# EAGLE design untitled (EAGLE 9.6.2)
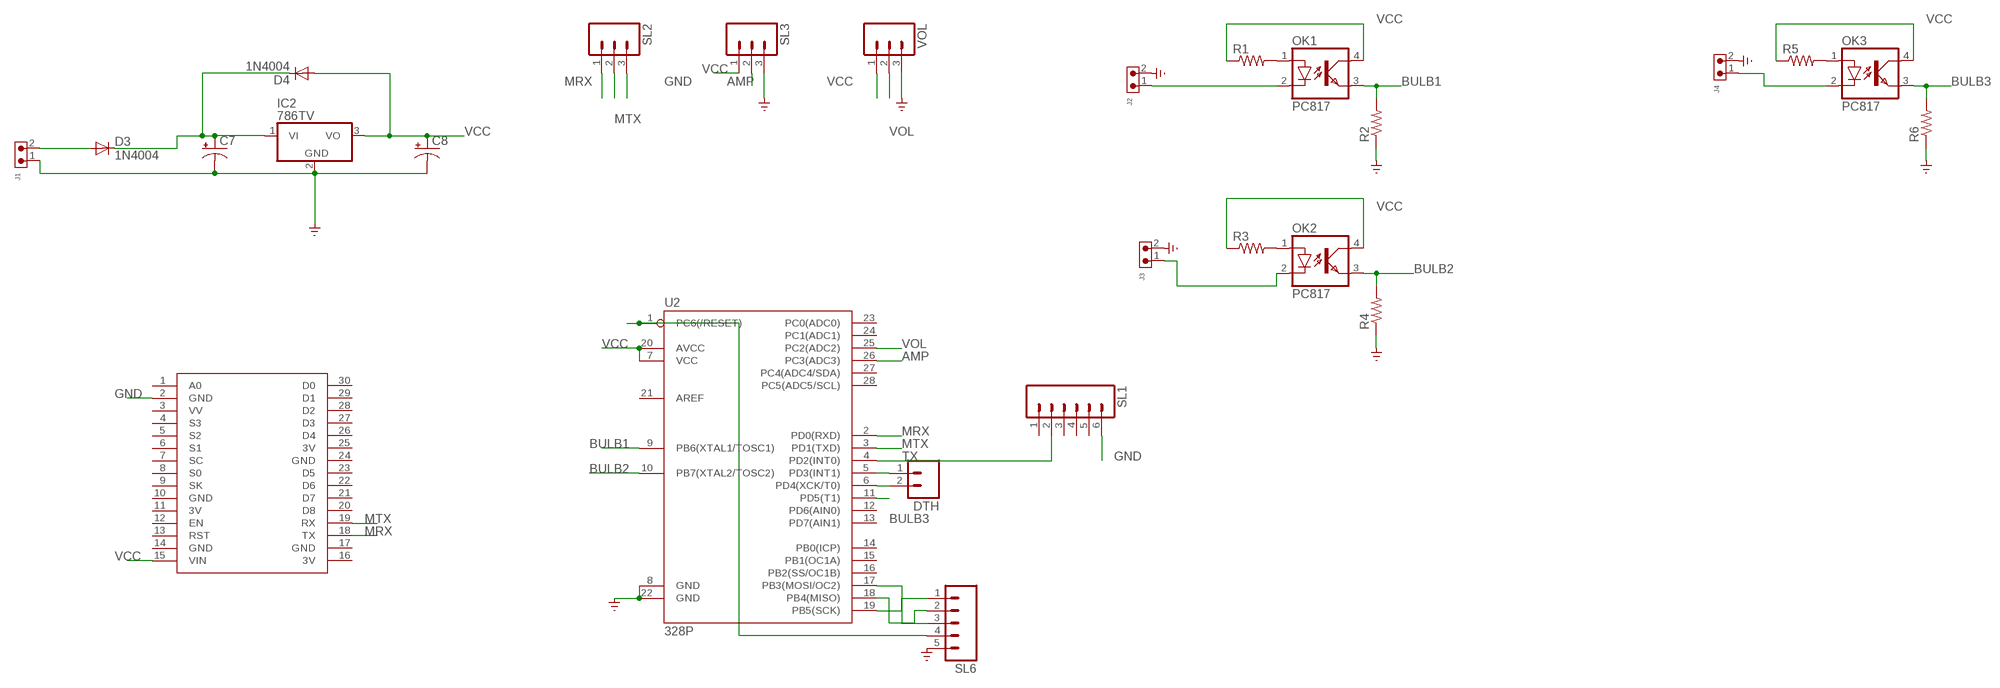
[diagram p0: schematic, sheet 1]

## Parts
C7  CAPACITOR-PE5-10.5  [E5-10,5]
C8  CAPACITOR-PE5-6  [E5-6]
D3  1N4004  [DO41-10]
D4  1N4004  [DO41-10]
DTH  M02  [02P]
IC2  786TV  [TO220V]
J1  691305530002  [691305530002]
J2  691305530002  [691305530002]
J3  691305530002  [691305530002]
J4  691305530002  [691305530002]
OK1  PC817  [DIL04]
OK2  PC817  [DIL04]
OK3  PC817  [DIL04]
R1  R-US_0207/10  [0207/10]
R2  R-US_0207/10  [0207/10]
R3  R-US_0207/10  [0207/10]
R4  R-US_0207/10  [0207/10]
R5  R-US_0207/10  [0207/10]
R6  R-US_0207/10  [0207/10]
SL1  M06  [06P]
SL2  M03  [03P]
SL3  M03  [03P]
SL6  M05  [05P]
U2  328P  ATMEGA328P_PDIP  [DIP28]
U$1  NODEMCU  [NODEMCU]
VOL  M03  [03P]

## Nets
AMP: SL3.2 U2.26(PC3(ADC3))
BULB1: OK1.3(EMIT) R2.2 U2.9(PB6(XTAL1/TOSC1))
BULB2: OK2.3(EMIT) R4.2 U2.10(PB7(XTAL2/TOSC2))
BULB3: OK3.3(EMIT) R6.2 U2.11(PD5(T1))
GND: C7.- C8.- IC2.2(GND) J1.1 J2.2 J3.2 J4.2 R2.1 R4.1 R6.1 SL1.6 SL2.3 SL3.3 SL6.5 U2.8(GND) U2.22(GND) U$1.2(GND) VOL.3 ; supply symbol labelled SUPPLY_BRASTAN_GND_
MRX: SL2.1 U2.2(PD0(RXD)) U$1.18(TX)
MTX: SL2.2 U2.3(PD1(TXD)) U$1.19(RX)
N$1: OK1.1(A) R1.2
N$2: DTH.1 U2.5(PD3(INT1))
N$4: DTH.2 U2.6(PD4(XCK/T0))
N$5: OK2.1(A) R3.2
N$6: OK3.1(A) R5.2
N$9: J2.1 OK1.2(C)
N$11: C7.+ D3.C D4.C IC2.1(VI)
N$12: J3.1 OK2.2(C)
N$14: SL6.4 U2.1(PC6(/RESET))
N$15: J4.1 OK3.2(C)
N$16: SL6.1 U2.19(PB5(SCK))
N$17: SL6.2 U2.18(PB4(MISO))
N$18: SL6.3 U2.17(PB3(MOSI/OC2))
N$21: D3.A J1.2
TX: SL1.2 U2.4(PD2(INT0))
VCC: C8.+ D4.A IC2.3(VO) OK1.4(COL) OK2.4(COL) OK3.4(COL) R1.1 R3.1 R5.1 SL3.1 U2.7(VCC) U2.20(AVCC) U$1.15(VIN) VOL.1
VOL: U2.25(PC2(ADC2)) VOL.2
Unconnected: SL1.1 SL1.3 SL1.4 SL1.5 U2.12(PD6(AIN0)) U2.13(PD7(AIN1)) U2.14(PB0(ICP)) U2.15(PB1(OC1A)) U2.16(PB2(SS/OC1B)) U2.21(AREF) U2.23(PC0(ADC0)) U2.24(PC1(ADC1)) U2.27(PC4(ADC4/SDA)) U2.28(PC5(ADC5/SCL)) U$1.1(A0) U$1.3(VV) U$1.4(S3) U$1.5(S2) U$1.6(S1) U$1.7(SC) U$1.8(S0) U$1.9(SK) U$1.12(EN) U$1.13(RST) U$1.20(D8) U$1.21(D7) U$1.22(D6) U$1.23(D5) U$1.26(D4) U$1.27(D3) U$1.28(D2) U$1.29(D1) U$1.30(D0)

## Power pins joined to a net without a drawn wire
3V: U$1.11(3V) U$1.16(3V) U$1.25(3V)
GND: U$1.10(GND) U$1.14(GND) U$1.17(GND) U$1.24(GND)

## Library data of the parts
C7 C8 = BeagleBone_Blue_R3:CAPACITOR-P: POLARIZED CAPACITOR, American symbol
D3 D4 = adafruit:1N4004: DIODE General purpose 1N400x type rectifier (With bigger pads) http://www.ladyada.net/library/pcb/eaglelibrary.html
DTH = con-amp-quick:M02: AMP QUICK CONNECTOR; OC_FARNELL: unknown; OC_NEWARK: unknown
IC2 = linear:78*: Positive VOLTAGE REGULATOR Source: http://cache.national.com/ds/LM/LM78L05.pdf http://www.fairchildsemi.com/ds/LM/LM7805.pdf
J1-J4 = Wurth_Connectors_WR-TBL Pluggable Connector:691305530002: WR-TBL Serie 3055 - 5,08 mm - PCB Header Vertical Entry with Plastic Latches KIND PROPERTIES Pitch 5.08 mm MATERIAL PROPERTIES Insulator Material PA66 Insulator Flammability Rating UL94 V-0 Insulator Color Green Terminal Material Copper Alloy Terminal Plating Tin-plated surface GENERAL INFORMATION Operating Temperature -40 up to +105 °C ELECTRICAL PROPERTIES IR UL 16 A Working Voltage [UL] 300 V (AC) Withstanding Voltage [UL] 2500 V (AC) Contact Resistance [UL] 20 mΩ CERTIFICATION UL Approval E315414 <https://www.we-online.com/catalog/media/o135349v209%20Family_WR-TBL3_6913055300xx.jpg> Details see: https://www.we-online.com/catalog/en/TBL_5_08_3055_6913055300XX/ Updated by Ella Wu 2019-12-30 2019(C) Wurth Elektronik; DATASHEET-URL: https://www.we-online.com/catalog/datasheet/691305530002.pdf; IR-UL: 16A; MOUNT: THT; PART-NUMBER: 691305530002; PINS: 2; PITCH: 5.08mm; TYPE: Vertical; WORKING-VOLTAGE-UL: 300V (AC)
OK1-OK3 = optocoupler:PC817: SHARP OPTO COUPLER; MPN: PC817X4J000F; OC_FARNELL: 9707727; OC_NEWARK: 97K7059
R1-R6 = BeagleBone_Black_Wireless:R-US_: RESISTOR, American symbol
SL1 = con-amp-quick:M06: AMP QUICK CONNECTOR; OC_FARNELL: unknown; OC_NEWARK: unknown
SL2 SL3 VOL = con-amp-quick:M03: AMP QUICK CONNECTOR; OC_FARNELL: unknown; OC_NEWARK: unknown
SL6 = con-amp-quick:M05: AMP QUICK CONNECTOR; OC_FARNELL: unknown; OC_NEWARK: unknown
U2 = SparkFun-IC-Microcontroller:ATMEGA328P_PDIP: Atmel 328P Through hole ATMEGA328P uC used in the Arduino 32kb flash, 1k EEPROM, 2k SRAM Datasheet <http://www.sparkfun.com/datasheets/Components/SMD/ATMega328.pdf> SparkFun Products Storefront component: AVR 28 Pin 20MHz 32K 6A/D - ATMega328P <https://www.sparkfun.com/products/9061> (COM-09061) SparkFun Simon Says - Through-Hole Soldering Kit <https://www.sparkfun.com/products/10547> (KIT-10547) SparkFun Learn to Solder - Simon Says <https://www.sparkfun.com/products/13708> (KIT-13708) SparkFun BigTime Watch Kit <https://www.sparkfun.com/products/11734> (KIT-11734) SparkFun ClockIt <https://www.sparkfun.com/products/10930> (KIT-10930) SparkFun Serial Enabled LCD Kit <https://www.sparkfun.com/products/10097> (LCD-10097) SparkFun Simon Tilts - Through Hole Soldering Kit <https://www.sparkfun.com/products/12634> (KIT-12634) SparkFun Frequency Counter Kit <https://www.sparkfun.com/products/10140> (KIT-10140) FabFM Radio Kit <https://www.sparkfun.com/products/11043> (KIT-11043) SparkFun Binary Blaster Kit <https://www.sparkfun.com/products/12037> (KIT-12037) SparkFun Metro-Gnome <https://www.sparkfun.com/products/9236> (KIT-09236) ATmega328 with Arduino Optiboot (Uno) <https://www.sparkfun.com/products/10524> (DEV-10524); PROD_ID: IC-09136
U$1 = nodemcu:NODEMCU

## Board
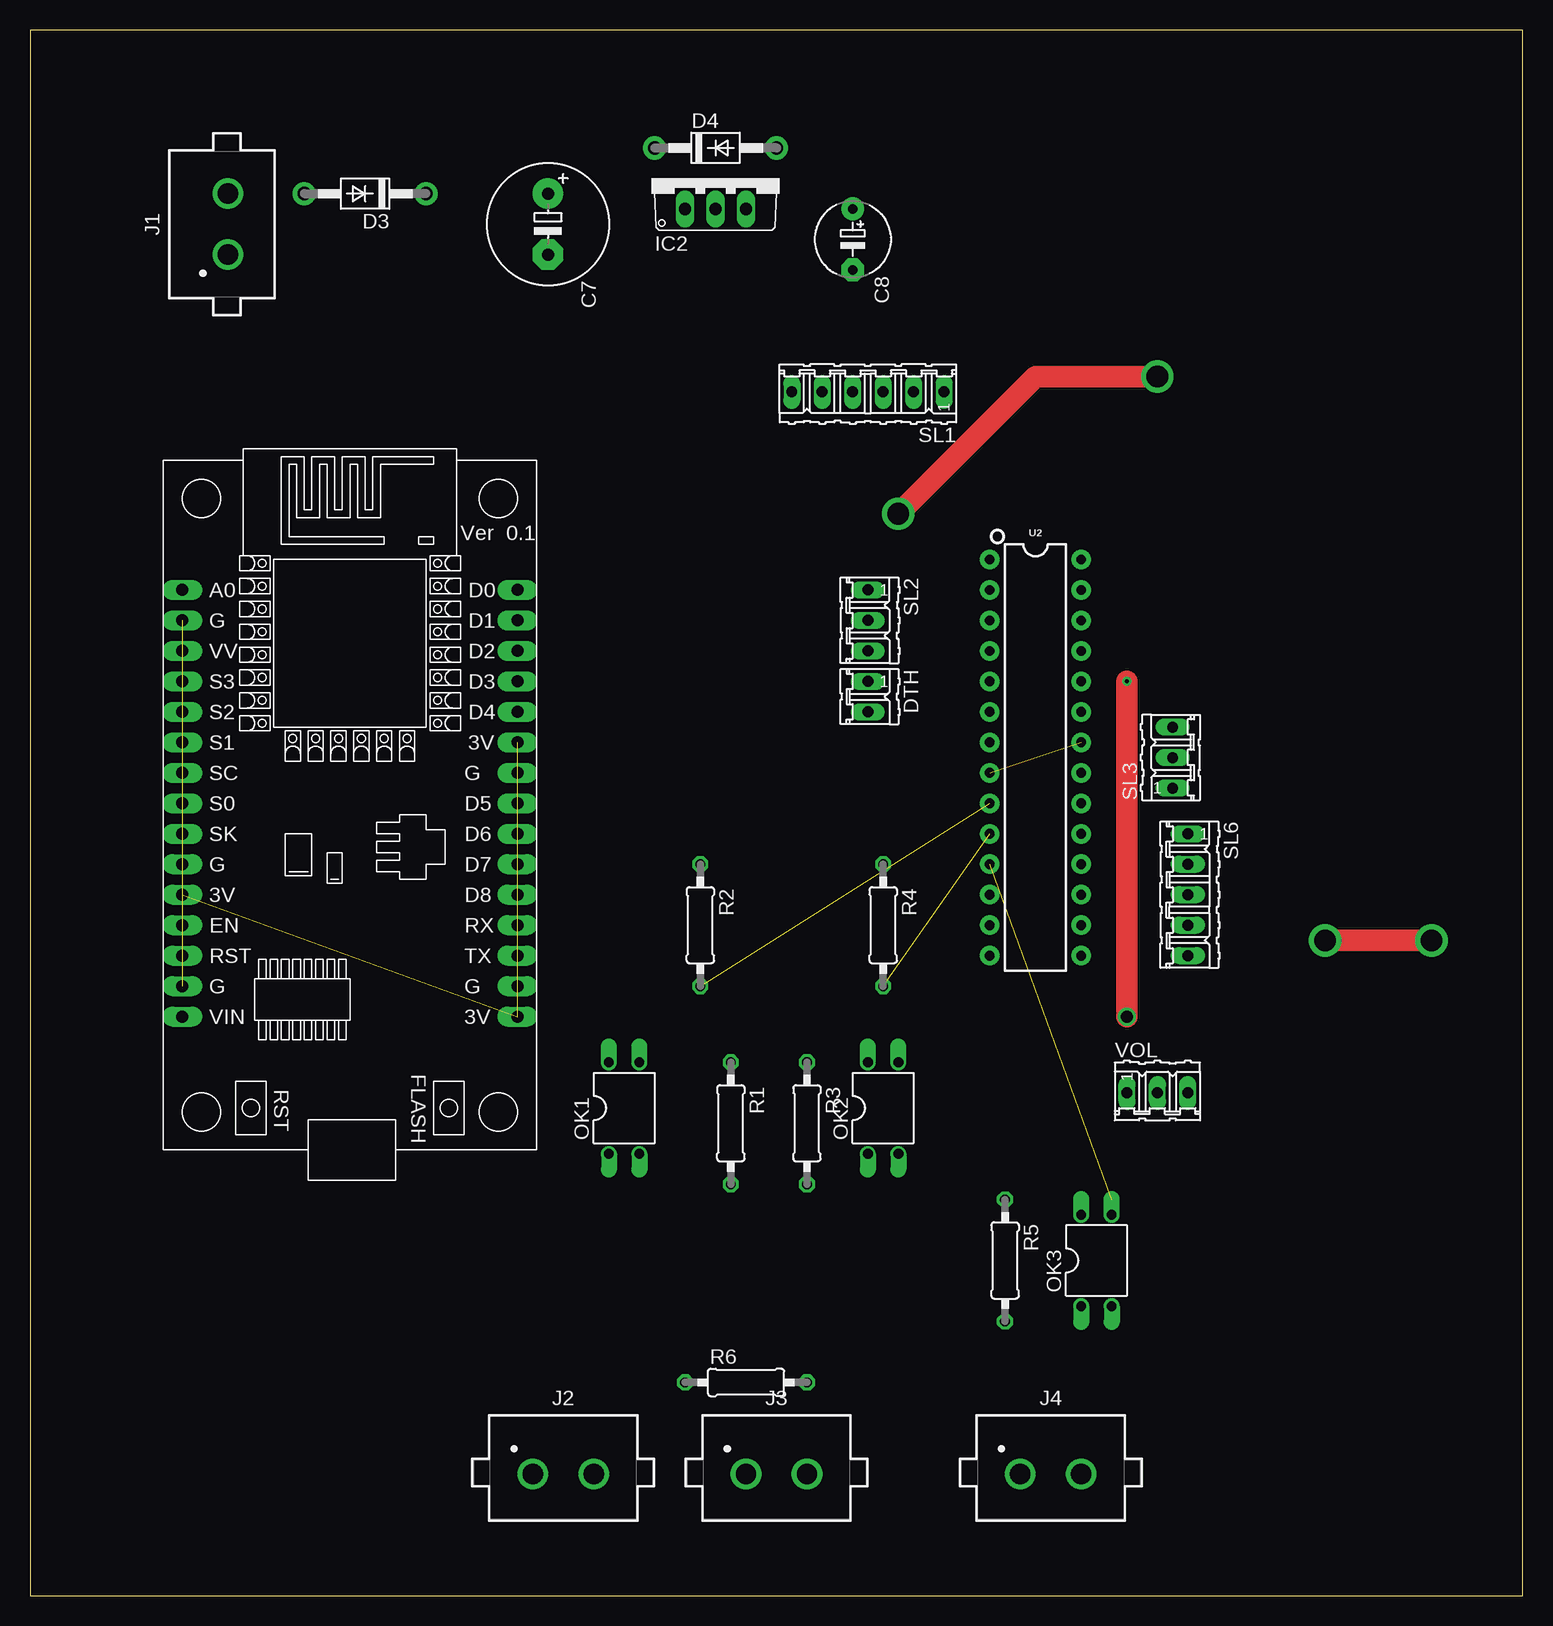
[diagram p1: board, top side]
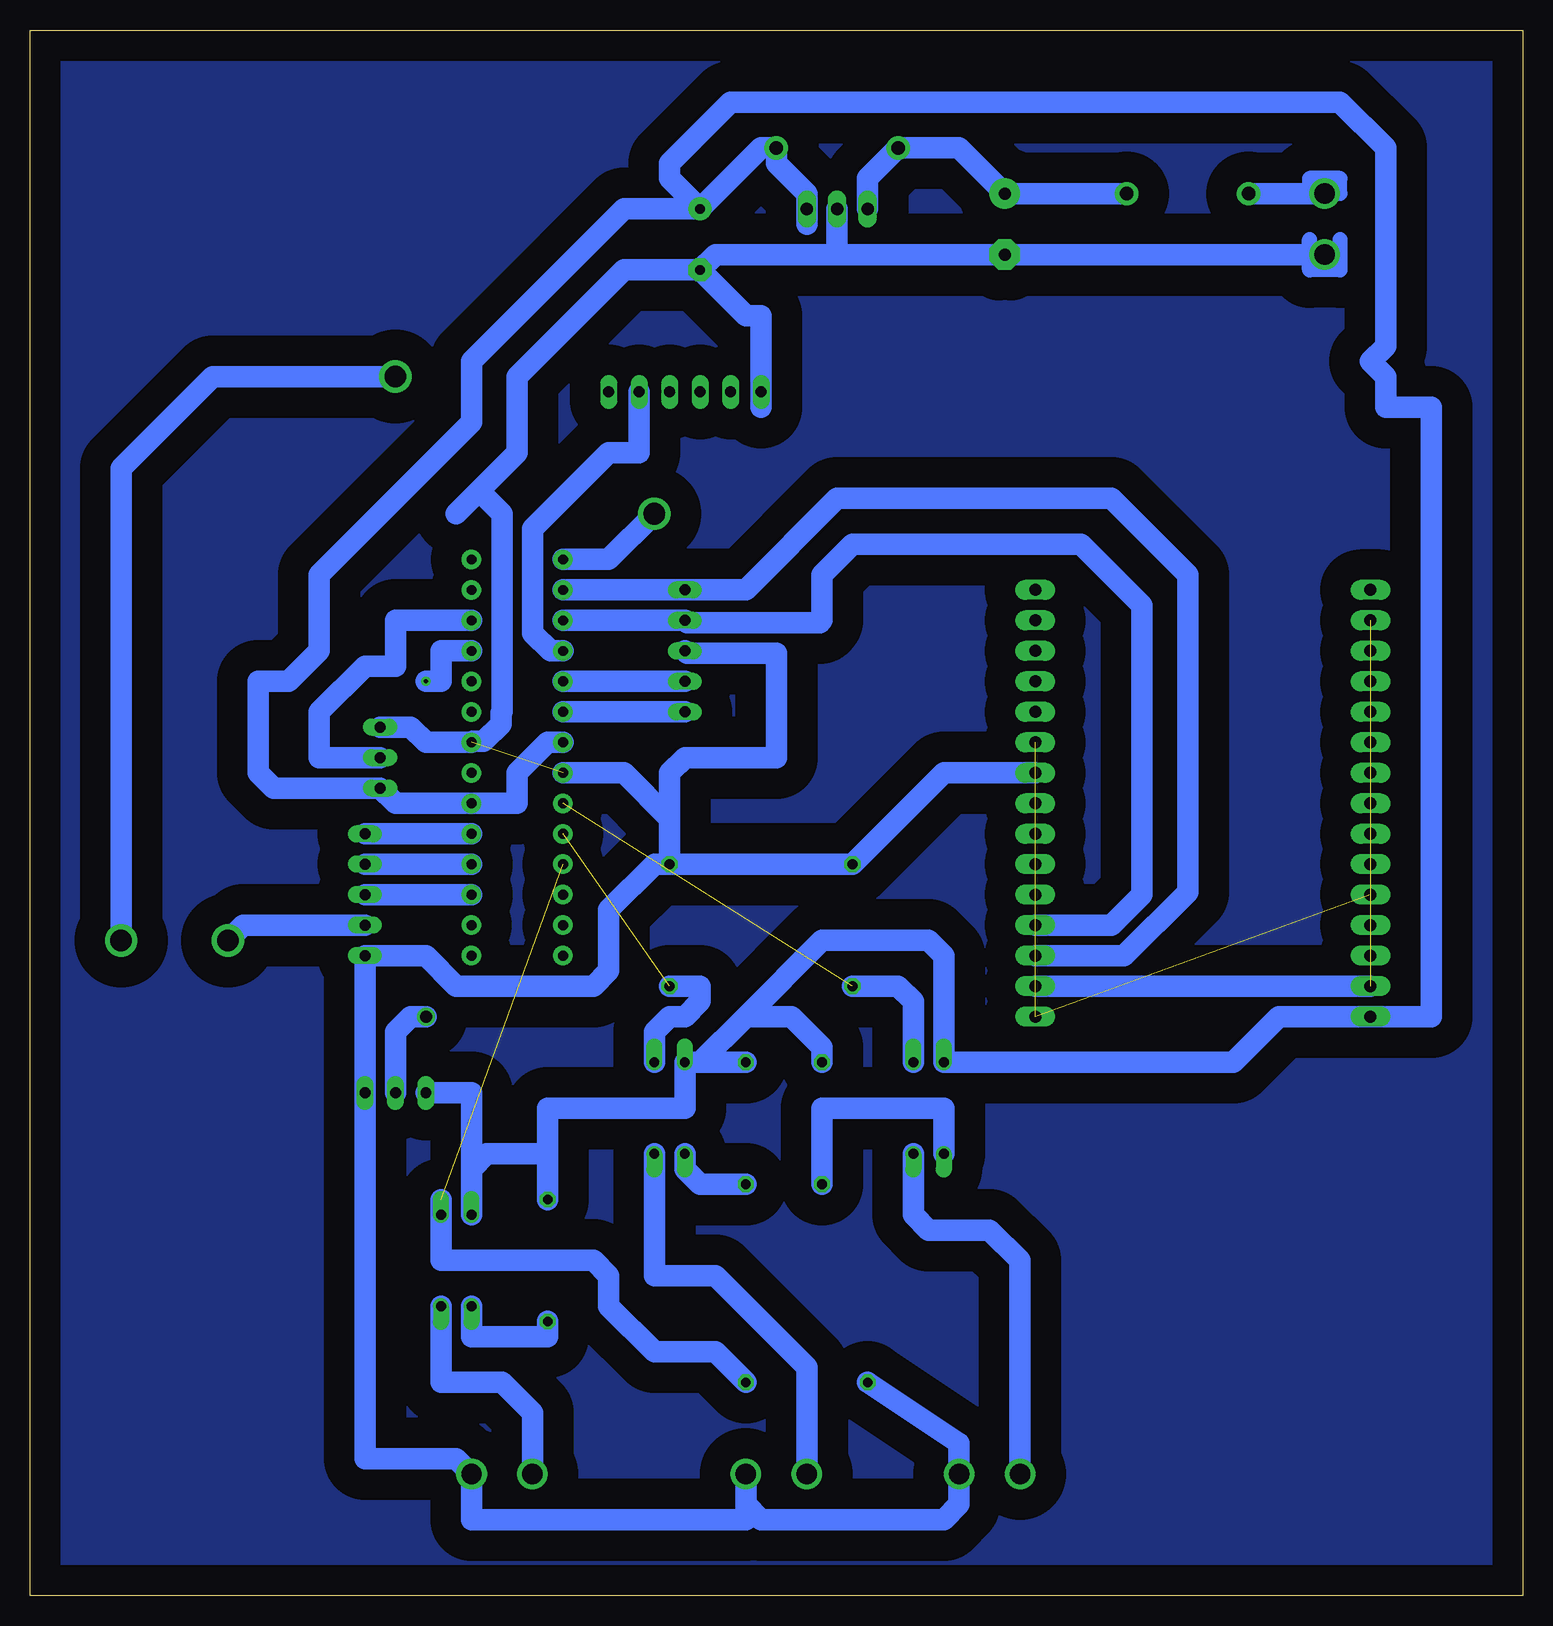
[diagram p2: board, bottom side, seen from below]

Size 124.44 x 130.48 mm. Coordinates in mm from the lower left corner, seen from the top.
Outline: 0,0 124.44,0 124.44,130.48 0,130.48 0,0
Copper layers (1*16): Top 0.035mm / dielectric 1.5mm / Bottom 0.035mm
Design rules "default *": minimum track width 6mil, minimum drill 0.35mm, track to track 30mil, track to pad 30mil, pad to pad 6mil, via to via 6mil, smd to smd 6mil, copper to edge 40mil, drill to drill 6mil, minimum pad ring 10mil, minimum via ring 8mil, stop-mask expansion 4mil, vias tented up to drill 0mil, thermal gap 10mil

### Footprints (pad centres in the part's own frame; a part is rotated, then mirrored left to right if it is on the bottom)
E5-10,5 = drill 1.016 pad 2.54: + -2.54,0 | drill 1.016 pad 2.54 octagon: - 2.54,0
E5-6 = drill 0.813 pad 1.905: + -2.54,0 | drill 0.813 pad 1.905 octagon: - 2.54,0
DO41-10 = drill 1.118 pad 1.93: A 5.08,0; C -5.08,0
02P = drill 0.914 long: 1 -1.27,0; 2 1.27,0
TO220V = drill 1.016 long: 1 -2.54,-2.54; 2 0,-2.54; 3 2.54,-2.54
691305530002 = drill 1.7: 1 -2.54,0; 2 2.54,0
DIL04 = drill 0.813 offset: 1 -1.27,-3.81; 2 1.27,-3.81; 3 1.27,3.81; 4 -1.27,3.81
0207/10 = drill 0.813 octagon: 1 -5.08,0; 2 5.08,0
06P = drill 0.914 long: 1 -6.35,0; 2 -3.81,0; 3 -1.27,0; 4 1.27,0; 5 3.81,0; 6 6.35,0
03P = drill 0.914 long: 1 -2.54,0; 2 0,0; 3 2.54,0
05P = drill 0.914 long: 1 -5.08,0; 2 -2.54,0; 3 0,0; 4 2.54,0; 5 5.08,0
DIP28 = drill 0.813 pad 1.626: 1 -16.51,-3.81; 2 -13.97,-3.81; 3 -11.43,-3.81; 4 -8.89,-3.81; 5 -6.35,-3.81; 6 -3.81,-3.81; 7 -1.27,-3.81; 8 1.27,-3.81; 9 3.81,-3.81; 10 6.35,-3.81; 11 8.89,-3.81; 12 11.43,-3.81; 13 13.97,-3.81; 14 16.51,-3.81; 15 16.51,3.81; 16 13.97,3.81; 17 11.43,3.81; 18 8.89,3.81; 19 6.35,3.81; 20 3.81,3.81; 21 1.27,3.81; 22 -1.27,3.81; 23 -3.81,3.81; 24 -6.35,3.81; 25 -8.89,3.81; 26 -11.43,3.81; 27 -13.97,3.81; 28 -16.51,3.81
NODEMCU = drill 1 pad 1.676 long: 1 -13.97,17.78; 2 -13.97,15.24; 3 -13.97,12.7; 4 -13.97,10.16; 5 -13.97,7.62; 6 -13.97,5.08; 7 -13.97,2.54; 8 -13.97,0; 9 -13.97,-2.54; 10 -13.97,-5.08; 11 -13.97,-7.62; 12 -13.97,-10.16; 13 -13.97,-12.7; 14 -13.97,-15.24; 15 -13.97,-17.78; 16 13.97,-17.78; 17 13.97,-15.24; 18 13.97,-12.7; 19 13.97,-10.16; 20 13.97,-7.62; 21 13.97,-5.08; 22 13.97,-2.54; 23 13.97,0; 24 13.97,2.54; 25 13.97,5.08; 26 13.97,7.62; 27 13.97,10.16; 28 13.97,12.7; 29 13.97,15.24; 30 13.97,17.78

### Placement (x,y rotation side)
C7  43.18,114.3 270 top
C8  68.58,113.03 270 top
D3  27.94,116.84 180 top
D4  57.15,120.65 0 top
DTH  69.85,74.93 270 top
IC2  57.15,118.11 0 top
J1  16.51,114.3 90 top
J2  44.45,10.16 0 top
J3  62.23,10.16 0 top
J4  85.09,10.16 0 top
OK1  49.53,40.64 0 top
OK2  71.12,40.64 0 top
OK3  88.9,27.94 0 top
R1  58.42,39.37 270 top
R2  55.88,55.88 270 top
R3  64.77,39.37 270 top
R4  71.12,55.88 270 top
R5  81.28,27.94 270 top
R6  59.69,17.78 0 top
SL1  69.85,100.33 180 top
SL2  69.85,81.28 270 top
SL3  95.25,69.85 90 top
SL6  96.52,58.42 270 top
U2  83.82,69.85 270 top
U$1  26.67,66.04 0 top
VOL  93.98,41.91 0 top

### Tracks (layer width: path | path; a pad name or v marks a point on that pad's centre or on a via)
3V  (2 unrouted)
AMP
  Bottom 1.778: U2.26 93.98,81.28 93.98,77.47 96.52,77.47 100.33,73.66 100.33,69.85 SL3.2
BULB1  (1 unrouted)
  Bottom 1.778: OK1.3 50.8,49.53 52.07,50.8 R2.2
BULB2  (1 unrouted)
  Bottom 1.778: OK2.3 72.39,46.99 71.12,48.26 69.85,48.26 68.58,49.53 68.58,50.8 R4.2
BULB3  (via drill 0.35)  (1 unrouted)
  Bottom 1.778: R6.2 67.31,20.32 72.39,20.32 76.2,24.13 76.2,26.67 77.47,27.94 90.17,27.94 OK3.3 90.17,33.02
  other vias: 90.17,31.75
GND  (4 unrouted)
  Bottom 1.778: J1.1 C7.- 57.15,111.76 | 57.15,111.76 IC2.2 | 57.15,111.76 67.31,111.76 C8.- | C8.- 64.77,106.68 63.5,106.68 SL1.6 63.5,99.06 | C8.- 74.93,110.49 83.82,101.6 83.82,95.25 87,92.08 | 88.9,90.17 87,92.08 | 87,92.08 85.09,90.17 85.09,73.66 85.17,73.58 85.17,72.64 86.61,71.2 87.55,71.2 U2.22 91.44,71.12 92.71,72.39 SL3.3 | VOL.3 SL6.5 91.44,53.34 88.9,50.8 77.47,50.8 76.2,52.07 76.2,57.15 72.39,60.96 R4.1 | 96.52,40.64 VOL.3 | R4.1 R2.1 48.26,68.58 U$1.24 | U$1.14 U$1.17 | R4.1 71.12,64.77 | 71.12,64.77 71.12,68.58 69.85,69.85 62.23,69.85 62.23,78.56 69.67,78.56 SL2.3 | R6.1 46.99,12.7 J2.2 46.99,7.62 48.26,6.35 63.5,6.35 64.77,7.62 | 64.77,7.62 J3.2 | 64.77,7.62 64.77,6.35 87.63,6.35 J4.2 88.9,11.43 96.52,11.43 VOL.3 | 71.12,64.77 74.93,68.58 U2.8
MRX
  Bottom 1.778: U2.2 SL2.1 64.77,83.82 57.15,91.44 34.29,91.44 27.94,85.09 27.94,58.64 33.24,53.34 U$1.18
MTX
  Bottom 1.778: U2.3 SL2.2 69.67,81.1 63.5,81.1 62.05,81.1 58.6,81.1 58.42,81.28 58.42,85.09 55.88,87.63 36.83,87.63 31.75,82.55 31.75,58.42 34.29,55.88 U$1.19
N$1
  Bottom 1.778: OK1.1 48.26,40.64 58.42,40.64 R1.2
N$2
  Bottom 1.778: DTH.1 U2.5
N$4
  Bottom 1.778: U2.6 DTH.2
N$5
  Bottom 1.778: R3.2 68.58,34.29 69.85,35.56 OK2.1
N$6
  Bottom 1.778: OK3.1 87.63,21.59 81.28,21.59 R5.2
N$8
  pour Bottom (isolate 2.54): 0,130.81 124.46,130.81 124.46,0 0,0
N$9
  Bottom 1.778: J2.1 41.91,27.94 44.45,30.48 49.53,30.48 50.8,31.75 OK1.2
N$11
  Bottom 1.778: D3.C C7.+ 46.99,120.65 D4.C 54.61,118.11 IC2.1
N$12
  Bottom 1.778: J3.1 59.69,19.05 67.31,26.67 72.39,26.67 OK2.2
N$14  (via drill 1.8)
  Top 1.778: v72.39,90.17 83.82,101.6 v93.98,101.6 | v116.84,54.61 v107.95,54.61
  Bottom 1.778: U2.1 76.2,86.36 v72.39,90.17 | v93.98,101.6 109.22,101.6 116.84,93.98 v116.84,54.61 | v107.95,54.61 106.68,55.88 SL6.4
N$15
  Bottom 1.778: J4.1 82.55,15.24 85.09,17.78 90.17,17.78 OK3.2
N$16
  Bottom 1.778: U2.19 SL6.1
N$17
  Bottom 1.778: U2.18 SL6.2
N$18
  Bottom 1.778: U2.17 SL6.3
N$20
  Bottom 1.27: 15.24,113.03 15.24,110.49 17.78,110.49 17.78,113.03
N$21
  Bottom 1.27: 15.24,116.84 15.24,118.11 17.78,118.11 17.78,116.84
  Bottom 1.778: J1.2 17.78,116.84 D3.A
TX
  Bottom 1.778: U2.4 81.06,78.74 82.55,80.23 82.55,88.9 76.2,95.25 73.66,95.25 SL1.2
VCC
  Bottom 1.778: C8.+ 63.5,120.65 D4.A 62.23,119.38 59.69,116.84 IC2.3 59.69,114.3 | C8.+ 71.12,118.11 71.12,119.38 66.04,124.46 15.24,124.46 11.43,120.65 11.43,104.14 12.7,102.87 11.43,101.6 11.43,99.06 7.62,99.06 7.62,48.26 U$1.15 20.32,48.26 24.13,44.45 OK1.4 48.26,53.34 49.53,54.61 58.42,54.61 64.77,48.26 | C8.+ 74.93,115.57 87.63,102.87 87.63,97.79 100.33,85.09 100.33,78.74 102.87,76.2 105.41,76.2 105.41,68.58 104.14,67.31 SL3.1 93.98,66.04 U2.20 83.82,66.04 83.82,68.58 81.28,71.12 U2.7 | 68.58,44.45 OK2.4 69.85,40.64 81.28,40.64 81.28,36.83 | 64.77,48.26 68.58,44.45 | R1.1 58.42,45.72 60.96,48.26 64.77,48.26 | R3.1 68.58,44.45 | 81.28,36.83 R5.1 | OK3.4 87.63,35.56 | 87.63,35.56 86.36,36.83 81.28,36.83 | 87.63,35.56 87.63,41.91 VOL.1
VOL  (via drill 0.35, 1)
  Top 1.778: v91.44,48.26 v91.44,76.2
  Bottom 1.778: U2.25 90.17,78.74 90.17,76.2 v91.44,76.2 | VOL.2 93.98,46.99 92.71,48.26 v91.44,48.26